# Altium project DiPho_devboard.PrjPcb
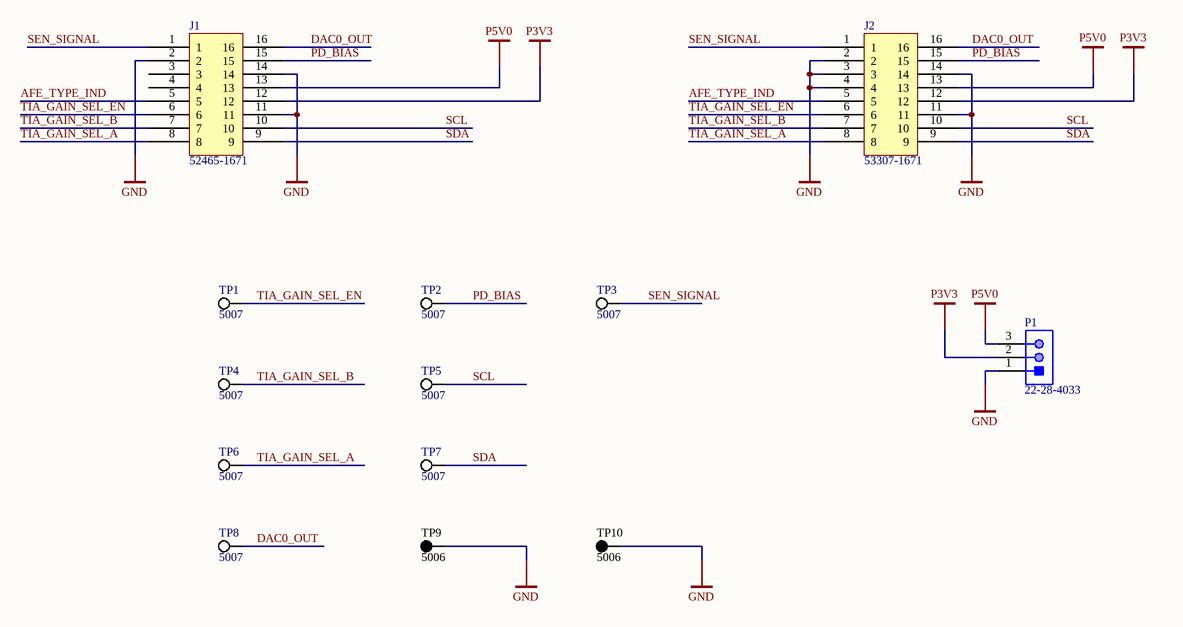
[diagram p0: DiPho_devboard.SchDoc]
1 sheet, 13 parts. Net scope: global (net labels, ports and power ports of the same name join across sheets).
Board file: DiPho_devboard.PcbDoc

## Sheet DiPho_devboard.SchDoc
size A4; SheetNumber: 1; SheetTotal: 1

### Parts
J1  52465-1671  [524651671]
J2  53307-1671  [533071671]
P1  22-28-4033  [MOLX-22-28-4033_V]
TP1  5007  [KSTN-5012_V]
TP2  5007  [KSTN-5012_V]
TP3  5007  [KSTN-5012_V]
TP4  5007  [KSTN-5012_V]
TP5  5007  [KSTN-5012_V]
TP6  5007  [KSTN-5012_V]
TP7  5007  [KSTN-5012_V]
TP8  5007  [KSTN-5012_V]
TP9  5006  [KSTN-5011_V]
TP10  5006  [KSTN-5011_V]

### Nets
GND: J1.2 J1.11 J1.14 J2.2 J2.3 J2.4 J2.11 J2.14 P1.1 TP9.1 TP10.1
P3V3: J1.12 J2.12 P1.2
P5V0: J1.13 J2.13 P1.3
AFE_TYPE_IND: J1.5 J2.5
DAC0_OUT: J1.16 J2.16 TP8.1
PD_BIAS: J1.15 J2.15 TP2.1
SCL: J1.10 J2.10 TP5.1
SDA: J1.9 J2.9 TP7.1
SEN_SIGNAL: J1.1 J2.1 TP3.1
TIA_GAIN_SEL_A: J1.8 J2.8 TP6.1
TIA_GAIN_SEL_B: J1.7 J2.7 TP4.1
TIA_GAIN_SEL_EN: J1.6 J2.6 TP1.1

Not connected (* = marked no-connect by the designer): J1 3 4

### Library data of the parts
J1 = 52465-1671: A Connector for Board - Board Connections with A 0.80 mm Pitch. (Molex); Supplier 1: Farnell; Manufacturer: Molex; Manufacturer Part Number: 52465-1671; RoHS: Yes; Category: Headers and Wire Housings; Stock 1: 1320; ComponentLink1URL: https://datasheet.ciiva.com/5130/0524651671-pcb-receptacles-170554-5130522.pdf?src-supplier=Mouser; ComponentLink1Description: https://datasheet.ciiva.com/5130/0524651671-pcb-receptacles-170554-5130522.pdf?src-supplier=Mouser; ComponentLink2URL: https://datasheet.ciiva.com/10078/0524651671-pcb-receptacles-10078959.pdf?src-supplier=Avnet; ComponentLink2Description: https://datasheet.ciiva.com/10078/0524651671-pcb-receptacles-10078959.pdf?src-supplier=Avnet; Supplier Part Number 1: 3500606
J2 = 53307-1671: 0.80mm Pitch Header Surface Mount Dual Row Vertical Stacking 4.50 and 5.50mm Stacking Heights 16 Circuits; Manufacturer: Molex; Supplier 1: Farnell; Manufacturer Part Number: 53307-1671; RoHS: Yes; Category: Headers and Wire Housings; Stock 1: 7000; ComponentLink1URL: https://datasheet.ciiva.com/5130/0533071671-pcb-headers-170920-5130475.pdf?src-supplier=Mouser; ComponentLink1Description: https://datasheet.ciiva.com/5130/0533071671-pcb-headers-170920-5130475.pdf?src-supplier=Mouser; ComponentLink2URL: https://datasheet.ciiva.com/1440/1875052-1440388.pdf?src-supplier=Element14; ComponentLink2Description: https://datasheet.ciiva.com/1440/1875052-1440388.pdf?src-supplier=Element14; ComponentLink3URL: https://datasheet.ciiva.com/10079/0533071671-pcb-headers-10079144.pdf?src-supplier=Avnet; ComponentLink3Description: https://datasheet.ciiva.com/10079/0533071671-pcb-headers-10079144.pdf?src-supplier=Avnet; Supplier Part Number 1: 3499278
P1 = CMP-1676-00001-5: Male Header, Pitch 2.54 mm, 1 x 3 Position, Height 8.38 mm, Tail Length 3.18 mm, RoHS, Bulk; Manufacturer: Molex; Rows: 1; Voltage Rating: 250 V; Current Rating: 4 A; Min Operating Temperature: 0 degC; Lead Pitch: 0.1 inch; Packaging: Bulk; Contact Finish: Gold; RoHSCompliant: true; Contact Material: Brass; PackageReference: 22-28-4033; REACH SVHC: Unknown; PackageDescription: Male Header, Pitch 2.54 mm, 1 x 3 Position, Height 8.38 mm, Tail Length 3.18 mm; ComponentLink2URL: http://www.molex.com/pdm_docs/sd/022284033_sd.pdf; Height: 8.38 mm; Mounting Technology: Through Hole; ComponentLink1Description: Manufacturer URL; Length: 7.62 mm; Mount: Through Hole; DatasheetVersion: Rev. G, 01/2012; Max Operating Temperature: 75 degC; ComponentLink2Description: Datasheet; Colour: Black; Pins: 3; Contact Plating: Gold; Package Quantity: 1; ComponentLink1URL: http://www.molex.com/; Manufacturer Part Number: 22-28-4033
TP1-TP8 = CMP-1672-00004-4: Test Point, White, Through Hole, RoHS, Bulk; Manufacturer: Keystone; DatasheetVersion: Rev. F, 12/2013; ComponentLink1URL: http://www.keyelco.com/; PackageReference: 5012; RoHSCompliant: true; ComponentLink2Description: Datasheet; Colour: White; Contact Material: Bronze; PackageDescription: 1-Pin Through Hole Device, Dia 3.17 mm; Mounting Technology: Through Hole; Mount: Through Hole; Package Quantity: 100; ComponentLink1Description: Manufacturer URL; Pins: 1; Height: 8.12 mm; Packaging: Bulk; REACH SVHC: No SVHC; Contact Plating: Silver; Length: 11.3 mm; ComponentLink2URL: http://www.keyelco.com/product-pdf.cfm?p=1321; Manufacturer Part Number: 5007
TP9 TP10 = CMP-1672-00003-4: Test Point, Black, Through Hole, RoHS, Bulk; Manufacturer: Keystone; ComponentLink2URL: http://www.keyelco.com/product-pdf.cfm?p=1320; Colour: Black; Pins: 1; REACH SVHC: No SVHC; ComponentLink1URL: http://www.keyelco.com/; PackageReference: 5011; Contact Plating: Silver; Package Quantity: 100; Packaging: Bulk; RoHSCompliant: true; Height: 8.12 mm; PackageDescription: 1-Pin Through Hole Device, Dia 3.17 mm; Mount: Through Hole; Mounting Technology: Through Hole; DatasheetVersion: Rev. F, 12/2013; ComponentLink1Description: Manufacturer URL; Contact Material: Bronze; ComponentLink2Description: Datasheet; Manufacturer Part Number: 5006